# EAGLE design hviezda (EAGLE 9.4.2)
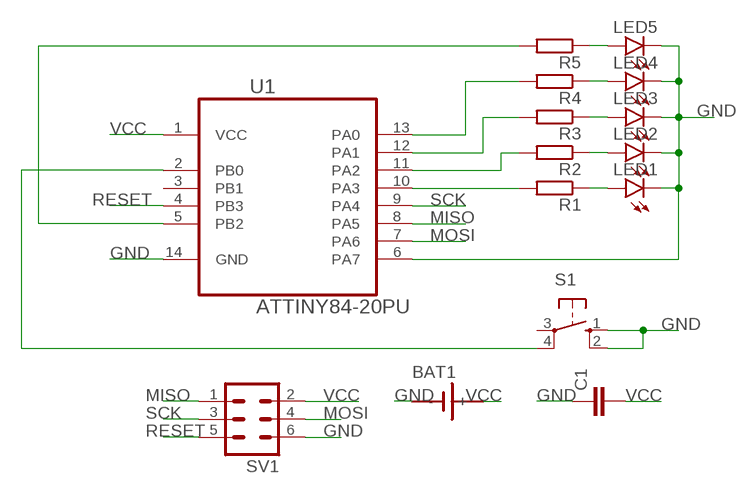
[diagram p0: schematic, sheet 1]

## Parts
BAT1  SN2032  [SN2032]
C1  C-EU050-024X044  [C050-024X044]
LED1  LED5MM  [LED5MM]
LED2  LED5MM  [LED5MM]
LED3  LED5MM  [LED5MM]
LED4  LED5MM  [LED5MM]
LED5  LED5MM  [LED5MM]
R1  R-EU_0207/10  [0207/10]
R2  R-EU_0207/10  [0207/10]
R3  R-EU_0207/10  [0207/10]
R4  R-EU_0207/10  [0207/10]
R5  R-EU_0207/10  [0207/10]
S1  10-XX  [B3F-10XX]
SV1  MA03-2  [MA03-2]
U1  ATTINY84-20PU  [DIP254P762X533-14]

## Nets
GND: BAT1.- C1.1 LED1.K(C) LED2.K(C) LED3.K(C) LED4.K(C) LED5.K(C) S1.1(S) S1.2(S1) SV1.6 U1.6(PA7) U1.14(GND)
MISO: SV1.1 U1.8(PA5)
MOSI: SV1.4 U1.7(PA6)
N$1: LED1.A R1.1
N$2: LED2.A R2.1
N$3: LED3.A R3.1
N$4: LED4.A R4.1
N$5: LED5.A R5.1
N$6: R1.2 U1.10(PA3)
N$7: R2.2 U1.11(PA2)
N$8: R3.2 U1.12(PA1)
N$9: R4.2 U1.13(PA0)
N$10: R5.2 U1.5(PB2)
N$11: S1.4(P1) U1.2(PB0)
RESET: SV1.5 U1.4(PB3)
SCK: SV1.3 U1.9(PA4)
VCC: BAT1.+ C1.2 SV1.2 U1.1(VCC)
Unconnected: S1.3(P) U1.3(PB1)

## Library data of the parts
BAT1 = sn2032:SN2032: LI BATTERY
C1 = rcl:C-EU: CAPACITOR, European symbol; SPICEPREFIX: C
LED1-LED5 = led:LED: LED OSRAM: - CHIPLED LG R971, LG N971, LY N971, LG Q971, LY Q971, LO R971, LY R971 LH N974, LH R974 LS Q976, LO Q976, LY Q976 LO Q996 - Hyper CHIPLED LW Q18S LB Q993, LB Q99A, LB R99A - SideLED LS A670, LO A670, LY A670, LG A670, LP A670 LB A673, LV A673, LT A673, LW A673 LH A674 LY A675 LS A676, LA A676, LO A676, LY A676, LW A676 LS A679, LY A679, LG A679 - Hyper Micro SIDELED® LS Y876, LA Y876, LO Y876, LY Y876 LT Y87S - SmartLED LW L88C, LW L88S LB L89C, LB L89S, LG L890 LS L89K, LO L89K, LY L89K LS L896, LA L896, LO L896, LY L896 - TOPLED LS T670, LO T670, LY T670, LG T670, LP T670 LSG T670, LSP T670, LSY T670, LOP T670, LYG T670 LG T671, LOG T671, LSG T671 LB T673, LV T673, LT T673, LW T673 LH T674 LS T676, LA T676, LO T676, LY T676, LB T676, LH T676, LSB T676, LW T676 LB T67C, LV T67C, LT T67C, LS T67K, LO T67K, LY T67K, LW E67C LS E67B, LA E67B, LO E67B, LY E67B, LB E67C, LV E67C, LT E67C LW T67C LS T679, LY T679, LG T679 LS T770, LO T770, LY T770, LG T770, LP T770 LB T773, LV T773, LT T773, LW T773 LH T774 LS E675, LA E675, LY E675, LS T675 LS T776, LA T776, LO T776, LY T776, LB T776 LHGB T686 LT T68C, LB T68C - Hyper Mini TOPLED® LB M676 - Mini TOPLED Santana® LG M470 LS M47K, LO M47K, LY M47K Source: http://www.osram.convergy.de LUXEON: - LUMILED® LXK2-PW12-R00, LXK2-PW12-S00, LXK2-PW14-U00, LXK2-PW14-V00 LXK2-PM12-R00, LXK2-PM12-S00, LXK2-PM14-U00 LXK2-PE12-Q00, LXK2-PE12-R00, LXK2-PE12-S00, LXK2-PE14-T00, LXK2-PE14-U00 LXK2-PB12-K00, LXK2-PB12-L00, LXK2-PB12-M00, LXK2-PB14-N00, LXK2-PB14-P00, LXK2-PB14-Q00 LXK2-PR12-L00, LXK2-PR12-M00, LXK2-PR14-Q00, LXK2-PR14-R00 LXK2-PD12-Q00, LXK2-PD12-R00, LXK2-PD12-S00 LXK2-PH12-R00, LXK2-PH12-S00 LXK2-PL12-P00, LXK2-PL12-Q00, LXK2-PL12-R00 Source: www.luxeon.com KINGBRIGHT: KA-3528ASYC Source: www.kingbright.com
R1-R5 = rcl:R-EU_: RESISTOR, European symbol; SPICEPREFIX: R
S1 = switch-omron:10-XX: OMRON SWITCH; MPN: B3F-1000; OC_FARNELL: 176432; OC_NEWARK: 36M3542
SV1 = con-lstb:MA03-2: PIN HEADER; OC_FARNELL: unknown; OC_NEWARK: unknown
U1 = attiny84:ATTINY84-20PU: 8-bit Microcontroller with In-System Programmable Flash; MPN: ATTINY84-20PU; OC_FARNELL: 1455160; OC_NEWARK: 68T3783; PACKAGE: PDIP-14; SUPPLIER: Atmel

## Board
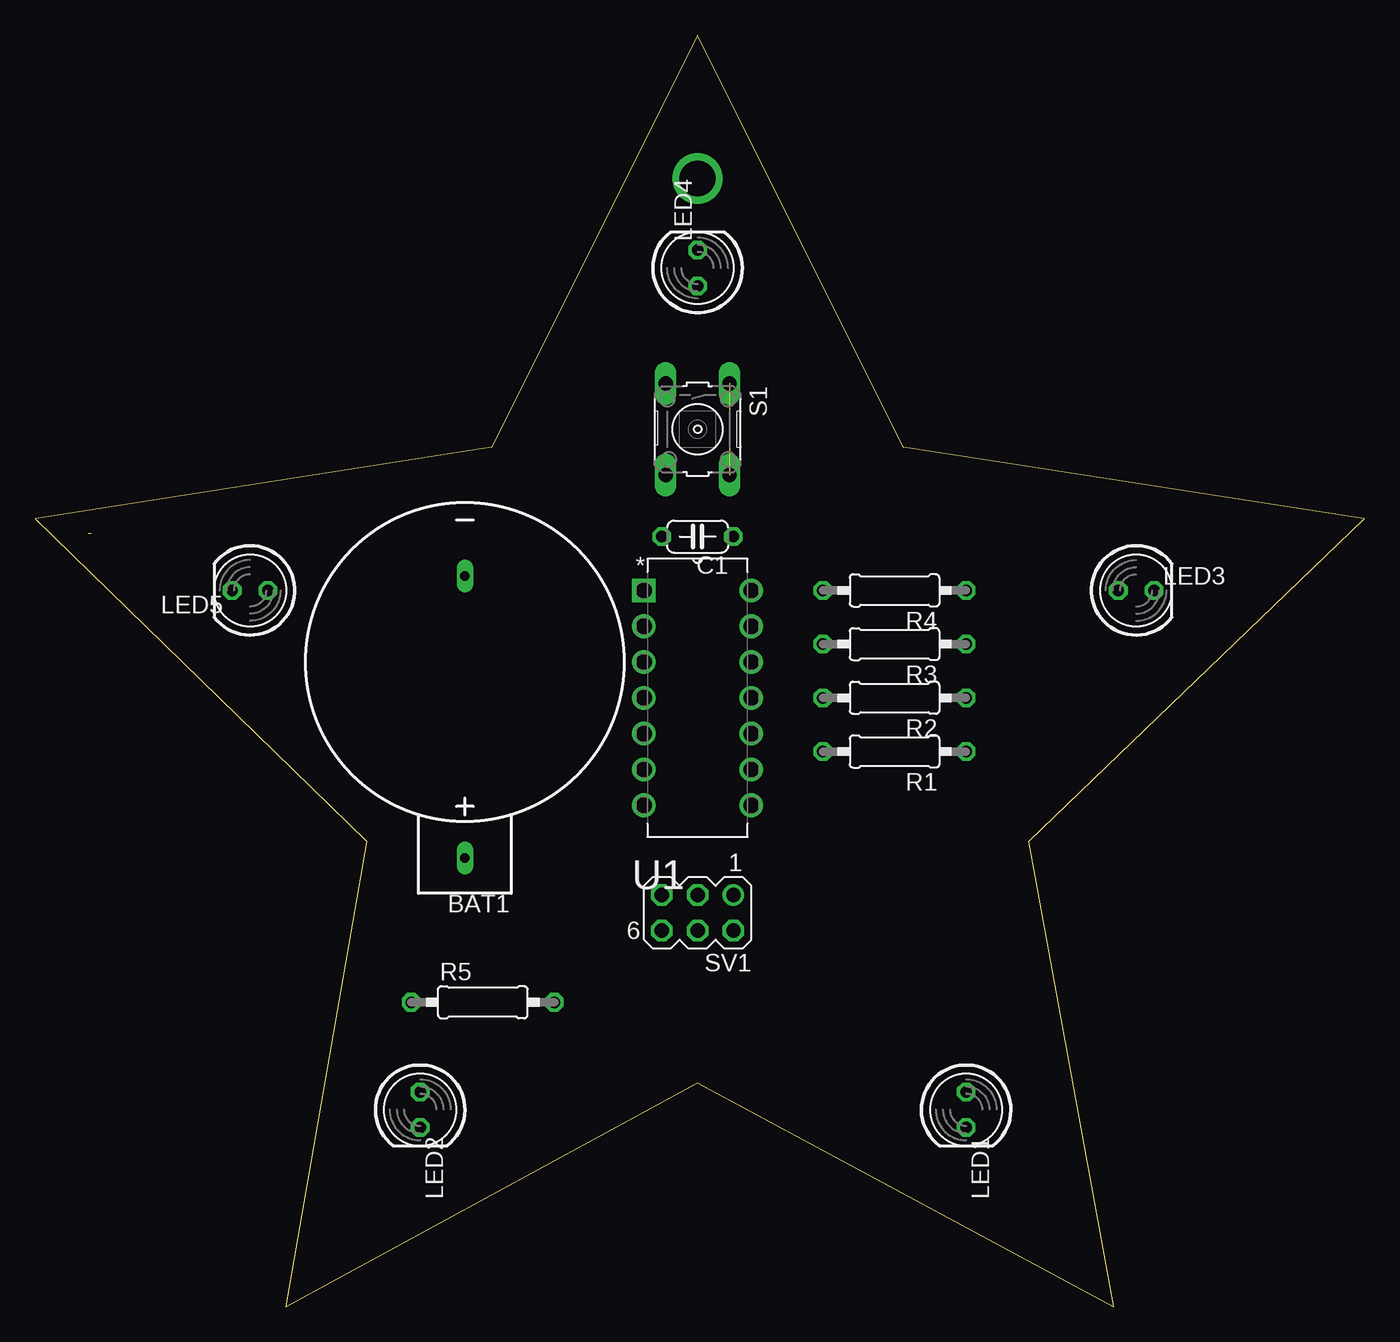
[diagram p1: board, top side]
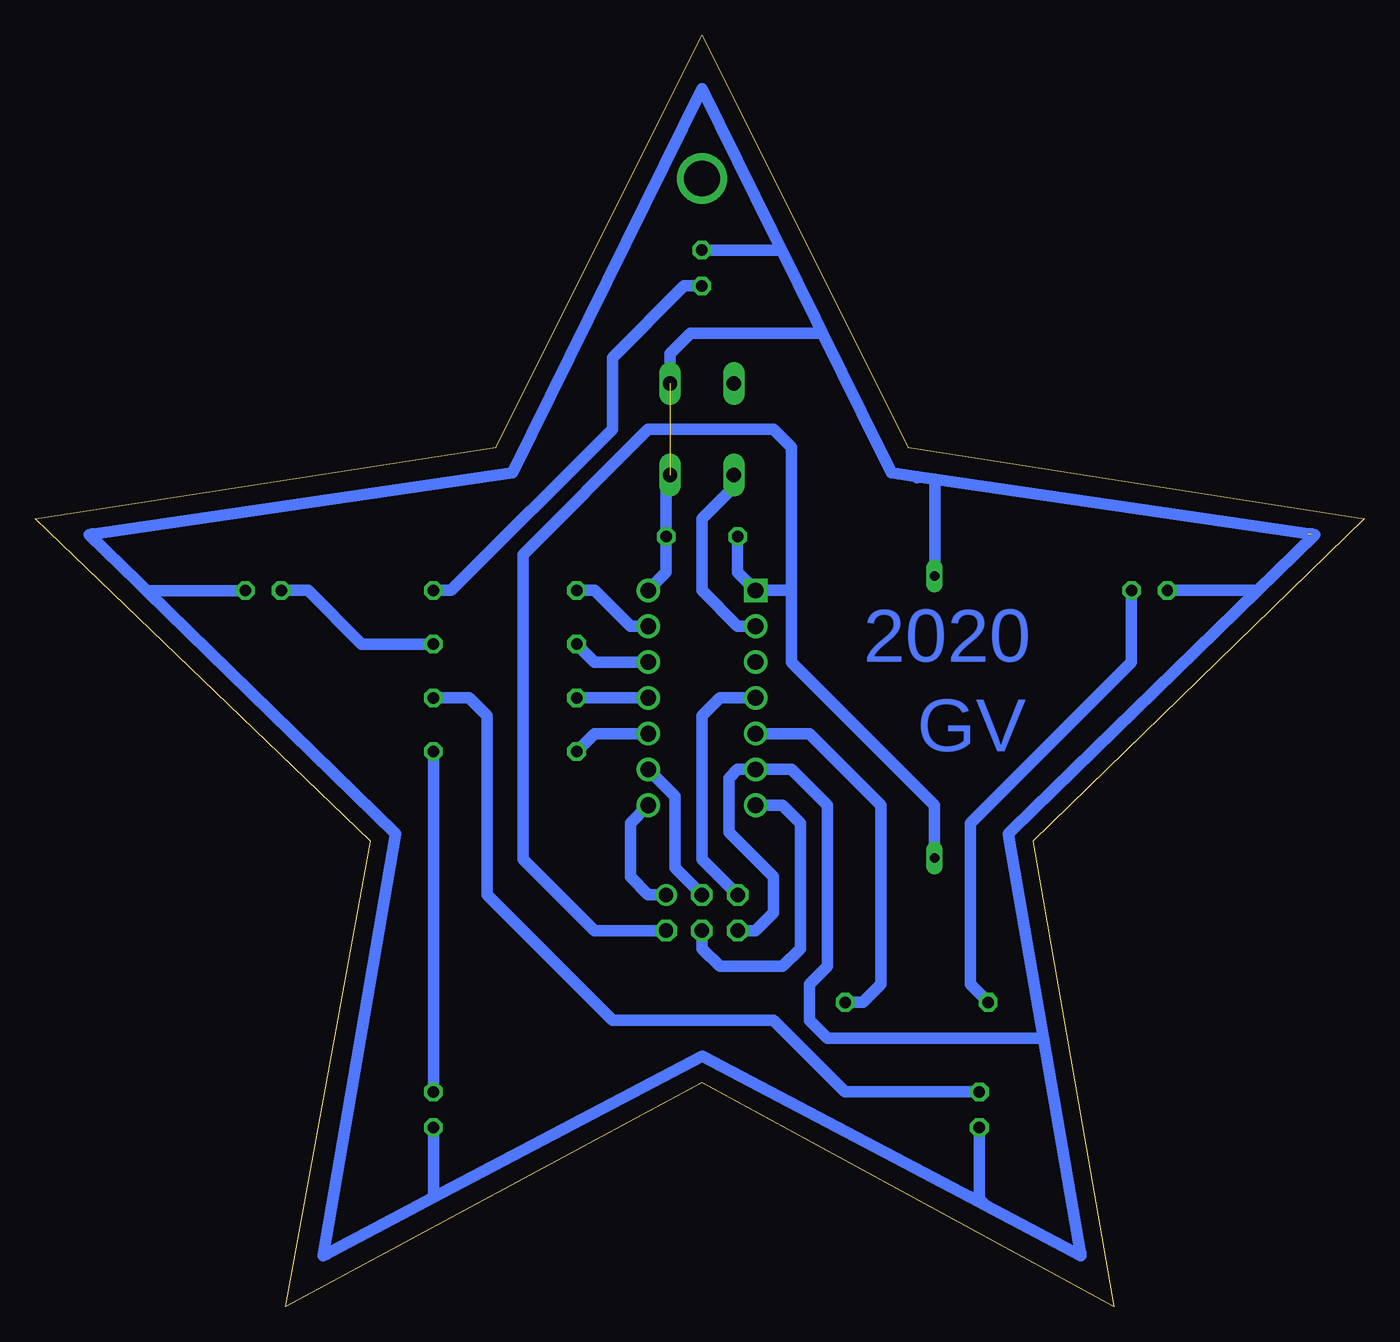
[diagram p2: board, bottom side, seen from below]

Size 94.28 x 90.17 mm. Coordinates in mm from the lower left corner, seen from the top.
Outline: 17.78,0 46.99,15.88 76.5,0 70.48,33.02 94.28,55.87 61.59,60.96 46.99,90.17 32.38,60.96 0,55.87 23.5,33.02 17.78,0
Copper layers (1*16): Top 0.035mm / dielectric 1.5mm / Bottom 0.035mm
Design rules "default": minimum track width 6mil, minimum drill 0.35mm, track to track 6mil, track to pad 6mil, pad to pad 6mil, via to via 6mil, smd to smd 6mil, copper to edge 40mil, drill to drill 6mil, minimum pad ring 10mil, minimum via ring 8mil, stop-mask expansion 4mil, vias tented up to drill 0mil, thermal gap 10mil

### Footprints (pad centres in the part's own frame; a part is rotated, then mirrored left to right if it is on the bottom)
SN2032 = drill 0.65 long: + 0,13.9; - 0,-6.1
C050-024X044 = drill 0.813 octagon: 1 -2.54,0; 2 2.54,0
LED5MM = drill 0.813 octagon: A -1.27,0; K 1.27,0
0207/10 = drill 0.813 octagon: 1 -5.08,0; 2 5.08,0
B3F-10XX = drill 1.016 long: 1 -3.251,2.261; 2 3.251,2.261; 3 -3.251,-2.261; 4 3.251,-2.261
MA03-2 = drill 1.016: 1 -2.54,-1.27 | drill 1.016 octagon: 2 -2.54,1.27; 3 0,-1.27; 4 0,1.27; 5 2.54,-1.27; 6 2.54,1.27
DIP254P762X533-14 = drill 1.118 square: 1 -7.62,15.24 | drill 1.118: 2 -7.62,12.7; 3 -7.62,10.16; 4 -7.62,7.62; 5 -7.62,5.08; 6 -7.62,2.54; 7 -7.62,0; 8 0,0; 9 0,2.54; 10 0,5.08; 11 0,7.62; 12 0,10.16; 13 0,12.7; 14 0,15.24

### Placement (x,y rotation side)
BAT1  30.48,45.72 180 top
C1  46.99,54.61 180 top
LED1  66.04,13.97 270 top
LED2  27.3,13.97 270 top
LED3  78.1,50.8 0 top
LED4  46.99,73.66 90 top
LED5  15.24,50.8 180 top
R1  60.96,39.37 180 top
R2  60.96,43.18 180 top
R3  60.96,46.99 180 top
R4  60.96,50.8 180 top
R5  31.75,21.59 0 top
S1  46.99,62.23 270 top
SV1  46.99,27.94 180 top
U1  50.8,35.56 0 top

### Tracks (layer width: path | path; a pad name or v marks a point on that pad's centre or on a via)
GND  (2 unrouted)
  Bottom 0.813: 73.63,3.73 73.86,3.63 | 90.45,54.76 90.22,54.82 | 3.76,54.82 3.5,54.76 | 20.11,3.83 20.09,3.63 | 3.96,54.3 3.96,54.82 | 46.99,17.78 66.09,7.72 | 66.09,7.72 67.09,7.2 73.86,3.63 | 73.86,3.63 68.71,33.55 86.37,50.79 | 86.37,50.79 87.01,51.41 | 87.01,51.41 90.45,54.76 | 90.45,54.76 60.43,59.13 46.99,86.36 41.96,76.18 41.45,75.16 | 41.45,75.16 38.93,70.07 38.43,69.05 | 38.43,69.05 35.66,63.45 33.53,59.13 31.69,58.86 | 31.69,58.86 30.44,58.68 | 30.44,58.68 3.5,54.76 | 3.5,54.76 7.59,50.77 | 7.59,50.77 24.96,33.84 25.25,33.55 25.16,33.06 24.28,27.91 | 24.28,27.91 23.39,22.77 23.21,21.75 22.75,19.07 | 22.75,19.07 20.09,3.63 | 20.09,3.63 26.89,7.21 | 26.89,7.21 27.88,7.73 | 27.88,7.73 46.97,17.78 | 27.94,7.79 27.88,7.73 | 87.01,51.41 87.01,51.42 | U1.14 49.53,52.07 C1.1 49.53,58.7 S1.2 | S1.1 49.25,67.59 47.8,69.05 38.43,69.05 | SV1.6 43.18,26.67 41.91,27.94 41.91,30.48 45.09,33.66 45.09,37.47 44.45,38.1 U1.6 40.64,38.1 38.1,35.56 38.1,24.13 39.37,22.86 39.37,20.32 38.1,19.05 22.77,19.05 22.75,19.07 | LED2.K 27.3,7.63 26.89,7.21 | LED1.K 66.04,7.78 66.09,7.72 | LED3.K 79.39,50.79 86.37,50.79 | LED5.K 7.62,50.8 7.59,50.77 | LED4.K 41.68,74.93 41.45,75.16 | 31.75,58.8 31.69,58.86 | 24.3,27.94 24.28,27.91 | BAT1.- 30.44,51.86 30.44,58.68
MISO
  Bottom 0.813: U1.8 52.07,34.29 52.07,30.48 50.8,29.21 SV1.1
MOSI
  Bottom 0.813: SV1.4 46.99,25.4 45.72,24.13 41.27,24.13 40,25.4 40,34.29 41.27,35.56 U1.7
N$1
  Bottom 0.813: R1.1 LED1.A
N$2
  Bottom 0.813: R2.1 63.5,43.18 62.23,41.91 62.23,29.21 53.34,20.32 41.91,20.32 36.83,15.24 LED2.A
N$3
  Bottom 0.813: R3.1 71.12,46.99 74.93,50.8 LED3.A
N$4
  Bottom 0.813: R4.1 64.77,50.8 53.34,62.23 53.34,67.31 48.26,72.39 LED4.A
N$5
  Bottom 0.813: R5.1 27.94,22.86 27.94,34.29 16.51,45.72 LED5.A
N$6
  Bottom 0.813: U1.10 54.61,40.64 R1.2
N$7
  Bottom 0.813: U1.11 R2.2
N$8
  Bottom 0.813: U1.12 54.61,45.72 R3.2
N$9
  Bottom 0.813: U1.13 52.07,48.26 54.61,50.8 R4.2
N$10
  Bottom 0.813: R5.2 35.56,21.59 34.29,22.86 34.29,35.56 39.37,40.64 U1.5
N$11
  Bottom 0.813: U1.2 44.45,48.26 46.99,50.8 46.99,55.88 44.73,58.14 S1.4
N$12  (via drill 2.54)
  other vias: 46.99,80.01
RESET
  Bottom 0.813: SV1.5 46.99,31.75 46.99,41.91 45.72,43.18 U1.4
SCK
  Bottom 0.813: U1.9 48.89,36.2 48.89,31.11 SV1.3
VCC
  Bottom 0.813: SV1.2 54.61,26.67 59.69,31.75 59.69,53.34 50.8,62.23 41.91,62.23 40.64,60.96 40.64,50.8 | C1.2 44.45,52.07 U1.1 40.64,50.8 | BAT1.+ 30.48,35.56 40.64,45.72 40.64,50.8

### Text on the board
Bottom: 2020 | GV